# Altium schematic sheet JETSON AGX SDIO-SPI-UART-CAN-GPIO.SchDoc: Jetson AGX SDIO-SPI-UART-CAN-GPIO
size 431 x 279 mm; CheckedBy: Lance Bantoto; Engineer: Cindy Li, Chealsie Bains; DocumentNumber: 7; Revision: 1; SheetNumber: 7; SheetTotal: 23
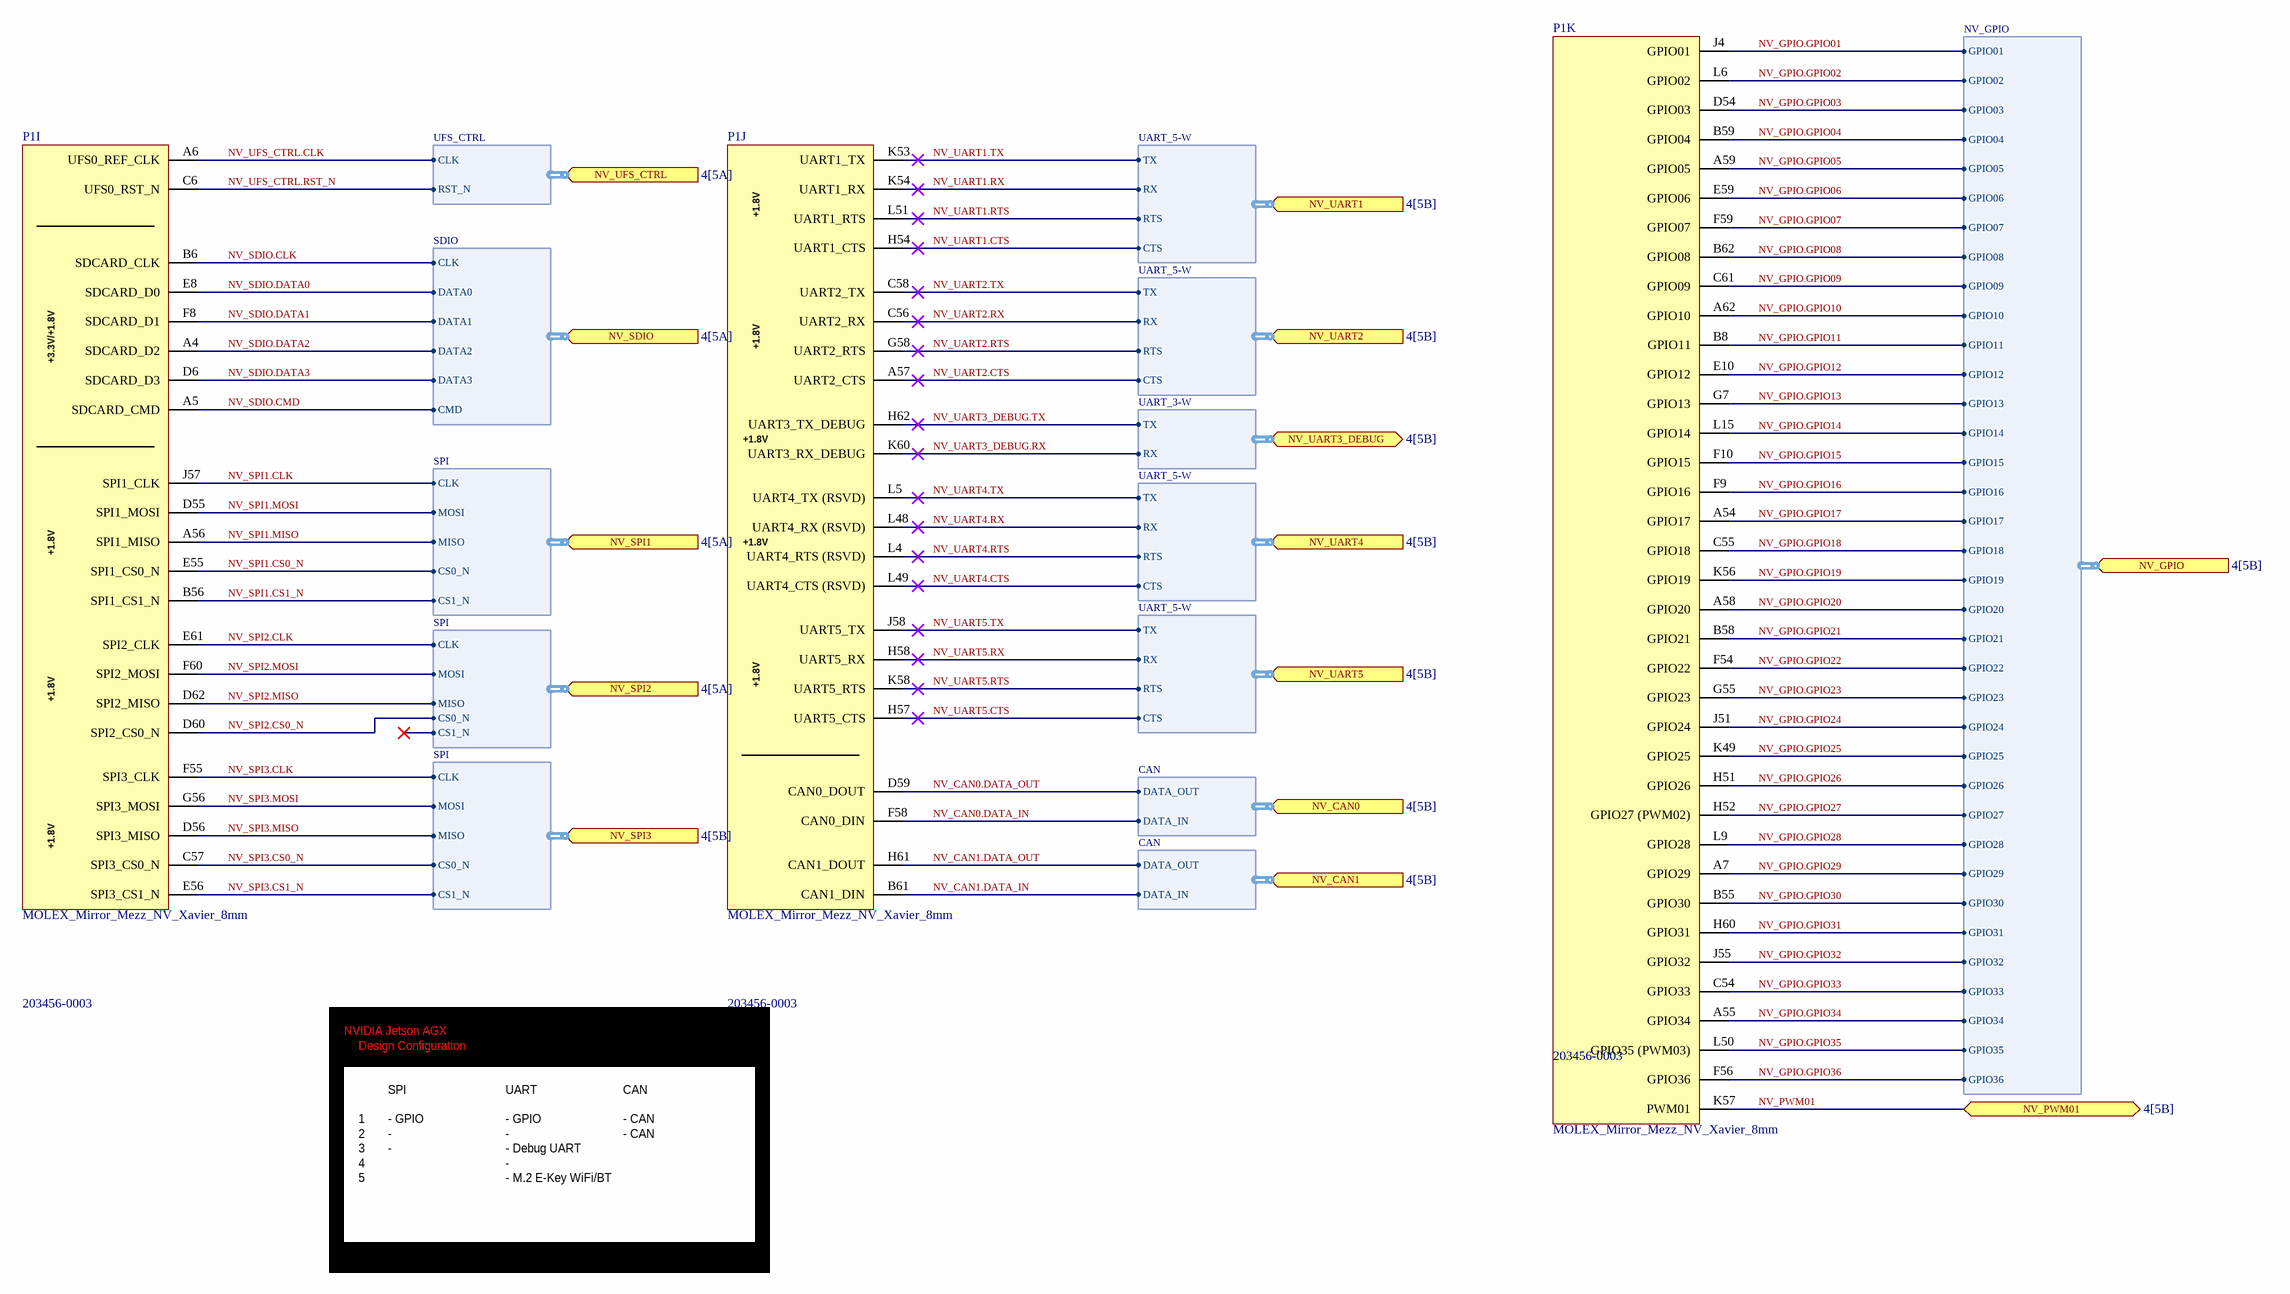
[diagram p0: JETSON AGX SDIO-SPI-UART-CAN-GPIO.SchDoc]

## Parts
P1  MOLEX_Mirror_Mezz_NV_Xavier_8mm  [203456-0003]  (parts I,J,K of 15)

## Ports
NV_CAN0 (in, harness CAN, see 4[5B]), NV_CAN1 (in, harness CAN, see 4[5B]), NV_GPIO (in, harness NV_GPIO, see 4[5B]), NV_PWM01 (bidir, see 4[5B]), NV_SDIO (in, harness SDIO, see 4[5A]), NV_SPI1 (in, harness SPI, see 4[5A]), NV_SPI2 (in, harness SPI, see 4[5A]), NV_SPI3 (in, harness SPI, see 4[5B]), NV_UART1 (in, harness UART_5-W, see 4[5B]), NV_UART2 (in, harness UART_5-W, see 4[5B]), NV_UART3_DEBUG (bidir, harness UART_3-W, see 4[5B]), NV_UART4 (in, harness UART_5-W, see 4[5B]), NV_UART5 (in, harness UART_5-W, see 4[5B]), NV_UFS_CTRL (in, harness UFS_CTRL, see 4[5A])

## Harnesses
SDIO: CLK, DATA0, DATA1, DATA2, DATA3, CMD
SPI: CLK, MOSI, MISO, CS0_N, CS1_N
UFS_CTRL: CLK, RST_N
UART_5-W: TX, RX, RTS, CTS
UART_3-W: TX, RX
CAN: DATA_OUT, DATA_IN
NV_GPIO: GPIO01, GPIO02, GPIO03, GPIO04, GPIO05, GPIO06, GPIO07, GPIO08, GPIO09, GPIO10, GPIO11, GPIO12, GPIO13, GPIO14, GPIO15, GPIO16, GPIO17, GPIO18, GPIO19, GPIO20, GPIO21, GPIO22, GPIO23, GPIO24, GPIO25, GPIO26, GPIO27, GPIO28, GPIO29, GPIO30, GPIO31, GPIO32, GPIO33, GPIO34, GPIO35, GPIO36

## Nets
NV_CAN0.DATA_IN: P1.F58(CAN0_DIN) ; port NV_CAN0.DATA_IN
NV_CAN0.DATA_OUT: P1.D59(CAN0_DOUT) ; port NV_CAN0.DATA_OUT
NV_CAN1.DATA_IN: P1.B61(CAN1_DIN) ; port NV_CAN1.DATA_IN
NV_CAN1.DATA_OUT: P1.H61(CAN1_DOUT) ; port NV_CAN1.DATA_OUT
NV_GPIO.GPIO01: P1.J4(GPIO01) ; port NV_GPIO.GPIO01
NV_GPIO.GPIO02: P1.L6(GPIO02) ; port NV_GPIO.GPIO02
NV_GPIO.GPIO03: P1.D54(GPIO03) ; port NV_GPIO.GPIO03
NV_GPIO.GPIO04: P1.B59(GPIO04) ; port NV_GPIO.GPIO04
NV_GPIO.GPIO05: P1.A59(GPIO05) ; port NV_GPIO.GPIO05
NV_GPIO.GPIO06: P1.E59(GPIO06) ; port NV_GPIO.GPIO06
NV_GPIO.GPIO07: P1.F59(GPIO07) ; port NV_GPIO.GPIO07
NV_GPIO.GPIO08: P1.B62(GPIO08) ; port NV_GPIO.GPIO08
NV_GPIO.GPIO09: P1.C61(GPIO09) ; port NV_GPIO.GPIO09
NV_GPIO.GPIO10: P1.A62(GPIO10) ; port NV_GPIO.GPIO10
NV_GPIO.GPIO11: P1.B8(GPIO11) ; port NV_GPIO.GPIO11
NV_GPIO.GPIO12: P1.E10(GPIO12) ; port NV_GPIO.GPIO12
NV_GPIO.GPIO13: P1.G7(GPIO13) ; port NV_GPIO.GPIO13
NV_GPIO.GPIO14: P1.L15(GPIO14) ; port NV_GPIO.GPIO14
NV_GPIO.GPIO15: P1.F10(GPIO15) ; port NV_GPIO.GPIO15
NV_GPIO.GPIO16: P1.F9(GPIO16) ; port NV_GPIO.GPIO16
NV_GPIO.GPIO17: P1.A54(GPIO17) ; port NV_GPIO.GPIO17
NV_GPIO.GPIO18: P1.C55(GPIO18) ; port NV_GPIO.GPIO18
NV_GPIO.GPIO19: P1.K56(GPIO19) ; port NV_GPIO.GPIO19
NV_GPIO.GPIO20: P1.A58(GPIO20) ; port NV_GPIO.GPIO20
NV_GPIO.GPIO21: P1.B58(GPIO21) ; port NV_GPIO.GPIO21
NV_GPIO.GPIO22: P1.F54(GPIO22) ; port NV_GPIO.GPIO22
NV_GPIO.GPIO23: P1.G55(GPIO23) ; port NV_GPIO.GPIO23
NV_GPIO.GPIO24: P1.J51(GPIO24) ; port NV_GPIO.GPIO24
NV_GPIO.GPIO25: P1.K49(GPIO25) ; port NV_GPIO.GPIO25
NV_GPIO.GPIO26: P1.H51(GPIO26) ; port NV_GPIO.GPIO26
NV_GPIO.GPIO27: P1.H52(GPIO27_(PWM02)) ; port NV_GPIO.GPIO27
NV_GPIO.GPIO28: P1.L9(GPIO28) ; port NV_GPIO.GPIO28
NV_GPIO.GPIO29: P1.A7(GPIO29) ; port NV_GPIO.GPIO29
NV_GPIO.GPIO30: P1.B55(GPIO30) ; port NV_GPIO.GPIO30
NV_GPIO.GPIO31: P1.H60(GPIO31) ; port NV_GPIO.GPIO31
NV_GPIO.GPIO32: P1.J55(GPIO32) ; port NV_GPIO.GPIO32
NV_GPIO.GPIO33: P1.C54(GPIO33) ; port NV_GPIO.GPIO33
NV_GPIO.GPIO34: P1.A55(GPIO34) ; port NV_GPIO.GPIO34
NV_GPIO.GPIO35: P1.L50(GPIO35_(PWM03)) ; port NV_GPIO.GPIO35
NV_GPIO.GPIO36: P1.F56(GPIO36) ; port NV_GPIO.GPIO36
NV_PWM01: P1.K57(PWM01) ; port NV_PWM01
NV_SDIO.CLK: P1.B6(SDCARD_CLK) ; port NV_SDIO.CLK
NV_SDIO.CMD: P1.A5(SDCARD_CMD) ; port NV_SDIO.CMD
NV_SDIO.DATA0: P1.E8(SDCARD_D0) ; port NV_SDIO.DATA0
NV_SDIO.DATA1: P1.F8(SDCARD_D1) ; port NV_SDIO.DATA1
NV_SDIO.DATA2: P1.A4(SDCARD_D2) ; port NV_SDIO.DATA2
NV_SDIO.DATA3: P1.D6(SDCARD_D3) ; port NV_SDIO.DATA3
NV_SPI1.CLK: P1.J57(SPI1_CLK) ; port NV_SPI1.CLK
NV_SPI1.CS0_N: P1.E55(SPI1_CS0_N) ; port NV_SPI1.CS0_N
NV_SPI1.CS1_N: P1.B56(SPI1_CS1_N) ; port NV_SPI1.CS1_N
NV_SPI1.MISO: P1.A56(SPI1_MISO) ; port NV_SPI1.MISO
NV_SPI1.MOSI: P1.D55(SPI1_MOSI) ; port NV_SPI1.MOSI
NV_SPI2.CLK: P1.E61(SPI2_CLK) ; port NV_SPI2.CLK
NV_SPI2.CS0_N: P1.D60(SPI2_CS0_N) ; port NV_SPI2.CS0_N
NV_SPI2.MISO: P1.D62(SPI2_MISO) ; port NV_SPI2.MISO
NV_SPI2.MOSI: P1.F60(SPI2_MOSI) ; port NV_SPI2.MOSI
NV_SPI3.CLK: P1.F55(SPI3_CLK) ; port NV_SPI3.CLK
NV_SPI3.CS0_N: P1.C57(SPI3_CS0_N) ; port NV_SPI3.CS0_N
NV_SPI3.CS1_N: P1.E56(SPI3_CS1_N) ; port NV_SPI3.CS1_N
NV_SPI3.MISO: P1.D56(SPI3_MISO) ; port NV_SPI3.MISO
NV_SPI3.MOSI: P1.G56(SPI3_MOSI) ; port NV_SPI3.MOSI
NV_UART1.CTS: P1.H54(UART1_CTS) ; port NV_UART1.CTS
NV_UART1.RTS: P1.L51(UART1_RTS) ; port NV_UART1.RTS
NV_UART1.RX: P1.K54(UART1_RX) ; port NV_UART1.RX
NV_UART1.TX: P1.K53(UART1_TX) ; port NV_UART1.TX
NV_UART2.CTS: P1.A57(UART2_CTS) ; port NV_UART2.CTS
NV_UART2.RTS: P1.G58(UART2_RTS) ; port NV_UART2.RTS
NV_UART2.RX: P1.C56(UART2_RX) ; port NV_UART2.RX
NV_UART2.TX: P1.C58(UART2_TX) ; port NV_UART2.TX
NV_UART3_DEBUG.RX: P1.K60(UART3_RX_DEBUG) ; port NV_UART3_DEBUG.RX
NV_UART3_DEBUG.TX: P1.H62(UART3_TX_DEBUG) ; port NV_UART3_DEBUG.TX
NV_UART4.CTS: P1.L49(UART4_CTS_(RSVD)) ; port NV_UART4.CTS
NV_UART4.RTS: P1.L4(UART4_RTS_(RSVD)) ; port NV_UART4.RTS
NV_UART4.RX: P1.L48(UART4_RX_(RSVD)) ; port NV_UART4.RX
NV_UART4.TX: P1.L5(UART4_TX_(RSVD)) ; port NV_UART4.TX
NV_UART5.CTS: P1.H57(UART5_CTS) ; port NV_UART5.CTS
NV_UART5.RTS: P1.K58(UART5_RTS) ; port NV_UART5.RTS
NV_UART5.RX: P1.H58(UART5_RX) ; port NV_UART5.RX
NV_UART5.TX: P1.J58(UART5_TX) ; port NV_UART5.TX
NV_UFS_CTRL.CLK: P1.A6(UFS0_REF_CLK) ; port NV_UFS_CTRL.CLK
NV_UFS_CTRL.RST_N: P1.C6(UFS0_RST_N) ; port NV_UFS_CTRL.RST_N

## Notes on the sheet
- +1.8V
- +3.3V/+1.8V
- NVIDIA Jetson AGX
- Design Configuration
- SPI
- UART
- CAN
- - CAN
  - CAN
- 1
  2
  3
  4
  5
- - GPIO
  -
  -
- - GPIO
  -
  - Debug UART
  -
  - M.2 E-Key WiFi/BT
- University of Waterloo Robotics Team
- 200 University Ave W
- REV
- PROJECT
- Waterloo, Ontario, Canada
- N2L 3G1
- DOCUMENT
- ENGINEER
- REVIEWER
- MODIFIED
- SHEET
- OF

## Library data of the parts
P1 = MOLEX_Mirror_Mezz_NV_Xavier_8mm: CONN SELF-MATE 699POS SMD GOLD; Manufacturer 1: Molex; Supplier 1: Digi-Key; Supplier Part Number 1: WM25528CT-ND; Manufacturer Part Number 1: 203456-0003